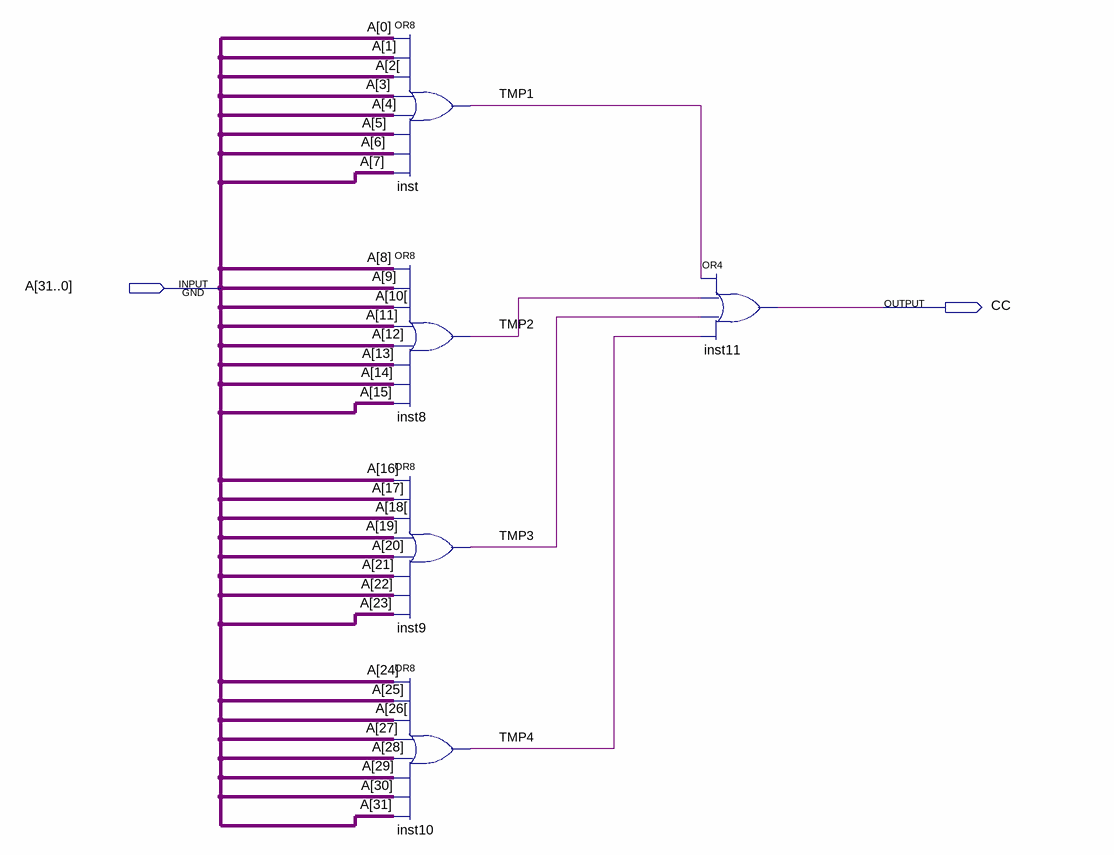
[diagram p0: schematic sheet]
// Quartus schematic or_group2.bdf as structural Verilog: 5 symbols, 2 pins
module or_group2 (
  input  [31:0] A,
  output CC
);

  wire \A[2[ , \A[10[ , \A[18[ , \A[26[ , TMP1, TMP2, TMP3, TMP4;

  or inst (TMP1, A[0], A[1], \A[2[ , A[3], A[4], A[5], A[6], A[7]);
  or inst8 (TMP2, A[8], A[9], \A[10[ , A[11], A[12], A[13], A[14], A[15]);
  or inst9 (TMP3, A[16], A[17], \A[18[ , A[19], A[20], A[21], A[22], A[23]);
  or inst10 (TMP4, A[24], A[25], \A[26[ , A[27], A[28], A[29], A[30], A[31]);
  or inst11 (CC, TMP1, TMP2, TMP3, TMP4);
endmodule
